# EAGLE schematic schemat-eagle (EAGLE 6.5.0)
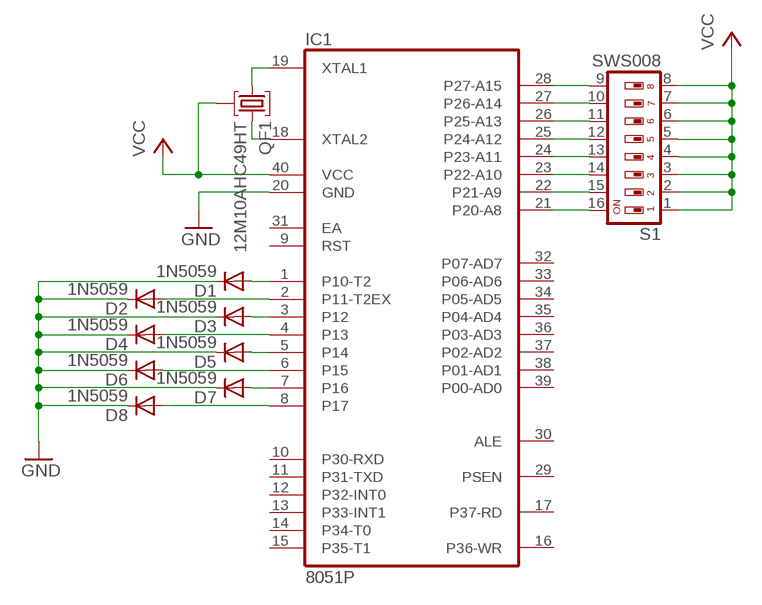
[diagram p0: schematic, sheet 1]

## Parts
D1  1N5059  [DO204-10]
D2  1N5059  [DO204-10]
D3  1N5059  [DO204-10]
D4  1N5059  [DO204-10]
D5  1N5059  [DO204-10]
D6  1N5059  [DO204-10]
D7  1N5059  [DO204-10]
D8  1N5059  [DO204-10]
IC1  8051P  [DIL40]
QF1  12M10AHC49HT  [HC49U]
S1  SWS008  [SMS-008]

## Nets
GND: D1.C D2.C D3.C D4.C D5.C D6.C D7.C D8.C IC1.20(GND)
N$1: D5.A IC1.5(P14)
N$2: D1.A IC1.1(P10-T2)
N$3: D2.A IC1.2(P11-T2EX)
N$4: D3.A IC1.3(P12)
N$5: D4.A IC1.4(P13)
N$6: D6.A IC1.6(P15)
N$7: D7.A IC1.7(P16)
N$8: D8.A IC1.8(P17)
N$10: IC1.28(P27-A15) S1.9
N$11: IC1.27(P26-A14) S1.10
N$12: IC1.26(P25-A13) S1.11
N$13: IC1.25(P24-A12) S1.12
N$14: IC1.24(P23-A11) S1.13
N$15: IC1.23(P22-A10) S1.14
N$16: IC1.22(P21-A9) S1.15
N$17: IC1.21(P20-A8) S1.16
N$26: IC1.19(XTAL1) QF1.1
N$27: IC1.18(XTAL2) QF1.3
VCC: IC1.40(VCC) QF1.2 S1.1 S1.2 S1.3 S1.4 S1.5 S1.6 S1.7 S1.8
Unconnected: IC1.9(RST) IC1.10(P30-RXD) IC1.11(P31-TXD) IC1.12(P32-INT0) IC1.13(P33-INT1) IC1.14(P34-T0) IC1.15(P35-T1) IC1.16(P36-WR) IC1.17(P37-RD) IC1.29(PSEN) IC1.30(ALE) IC1.31(EA) IC1.32(P07-AD7) IC1.33(P06-AD6) IC1.34(P05-AD5) IC1.35(P04-AD4) IC1.36(P03-AD3) IC1.37(P02-AD2) IC1.38(P01-AD1) IC1.39(P00-AD0)

## Library data of the parts
D1-D8 = diode:1N5059: DIODE controlled avalanche rectifier
IC1 = micro-intel:8051: (CHMOS) SINGLE-CHIP 8-BIT MICROCONTROLLER 80C31BH / 80C51 BH / 87C51 MCS 51 Source: http://apps.intel.com .. 27041907.pdf; OC_FARNELL: unknown; OC_NEWARK: unknown
QF1 = crystal:12M10AHC49HT: Monolithic Crystal Filters Source: www.vanlong.com; OC_FARNELL: unknown; OC_NEWARK: unknown
S1 = smd-special:SWS008: SMD Dip Switch 8 pol.